# EAGLE design MSP-EXP430FR5994_EagleCAD (EAGLE 7.5.0)
DRAWN: Mike Stein; REV: 1.1

## Sheet 1 of 7
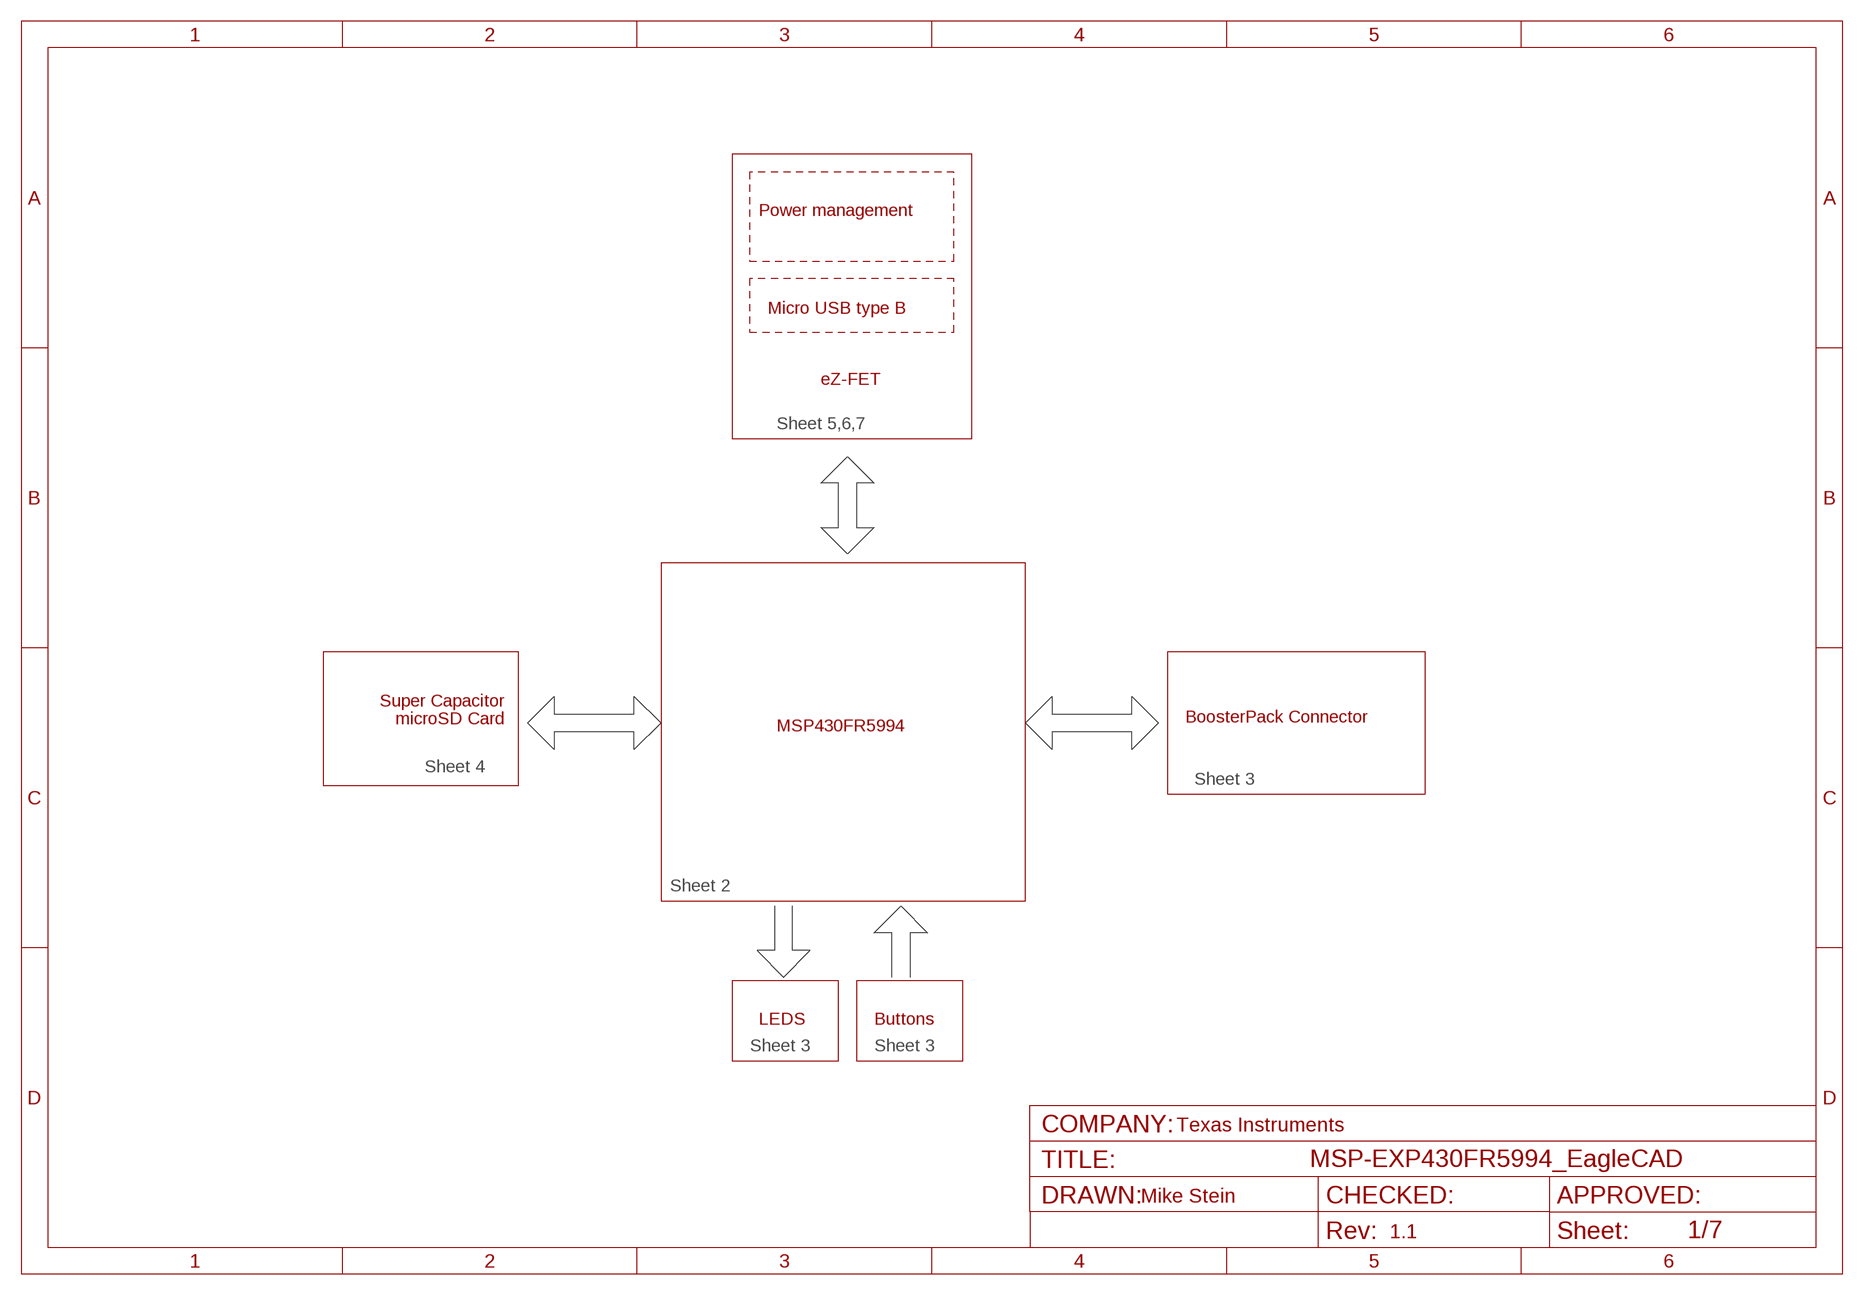
[diagram p0: schematic, sheet 1]

### Notes on the sheet
- Power management
- Micro USB type B
- eZ-FET
- Sheet 5,6,7
- Super Capacitor
- microSD Card
- BoosterPack Connector
- MSP430FR5994
- Sheet 4
- Sheet 3
- Sheet 2
- LEDS | Buttons
- Sheet 3 | Sheet 3
- Texas Instruments

## Sheet 2 of 7
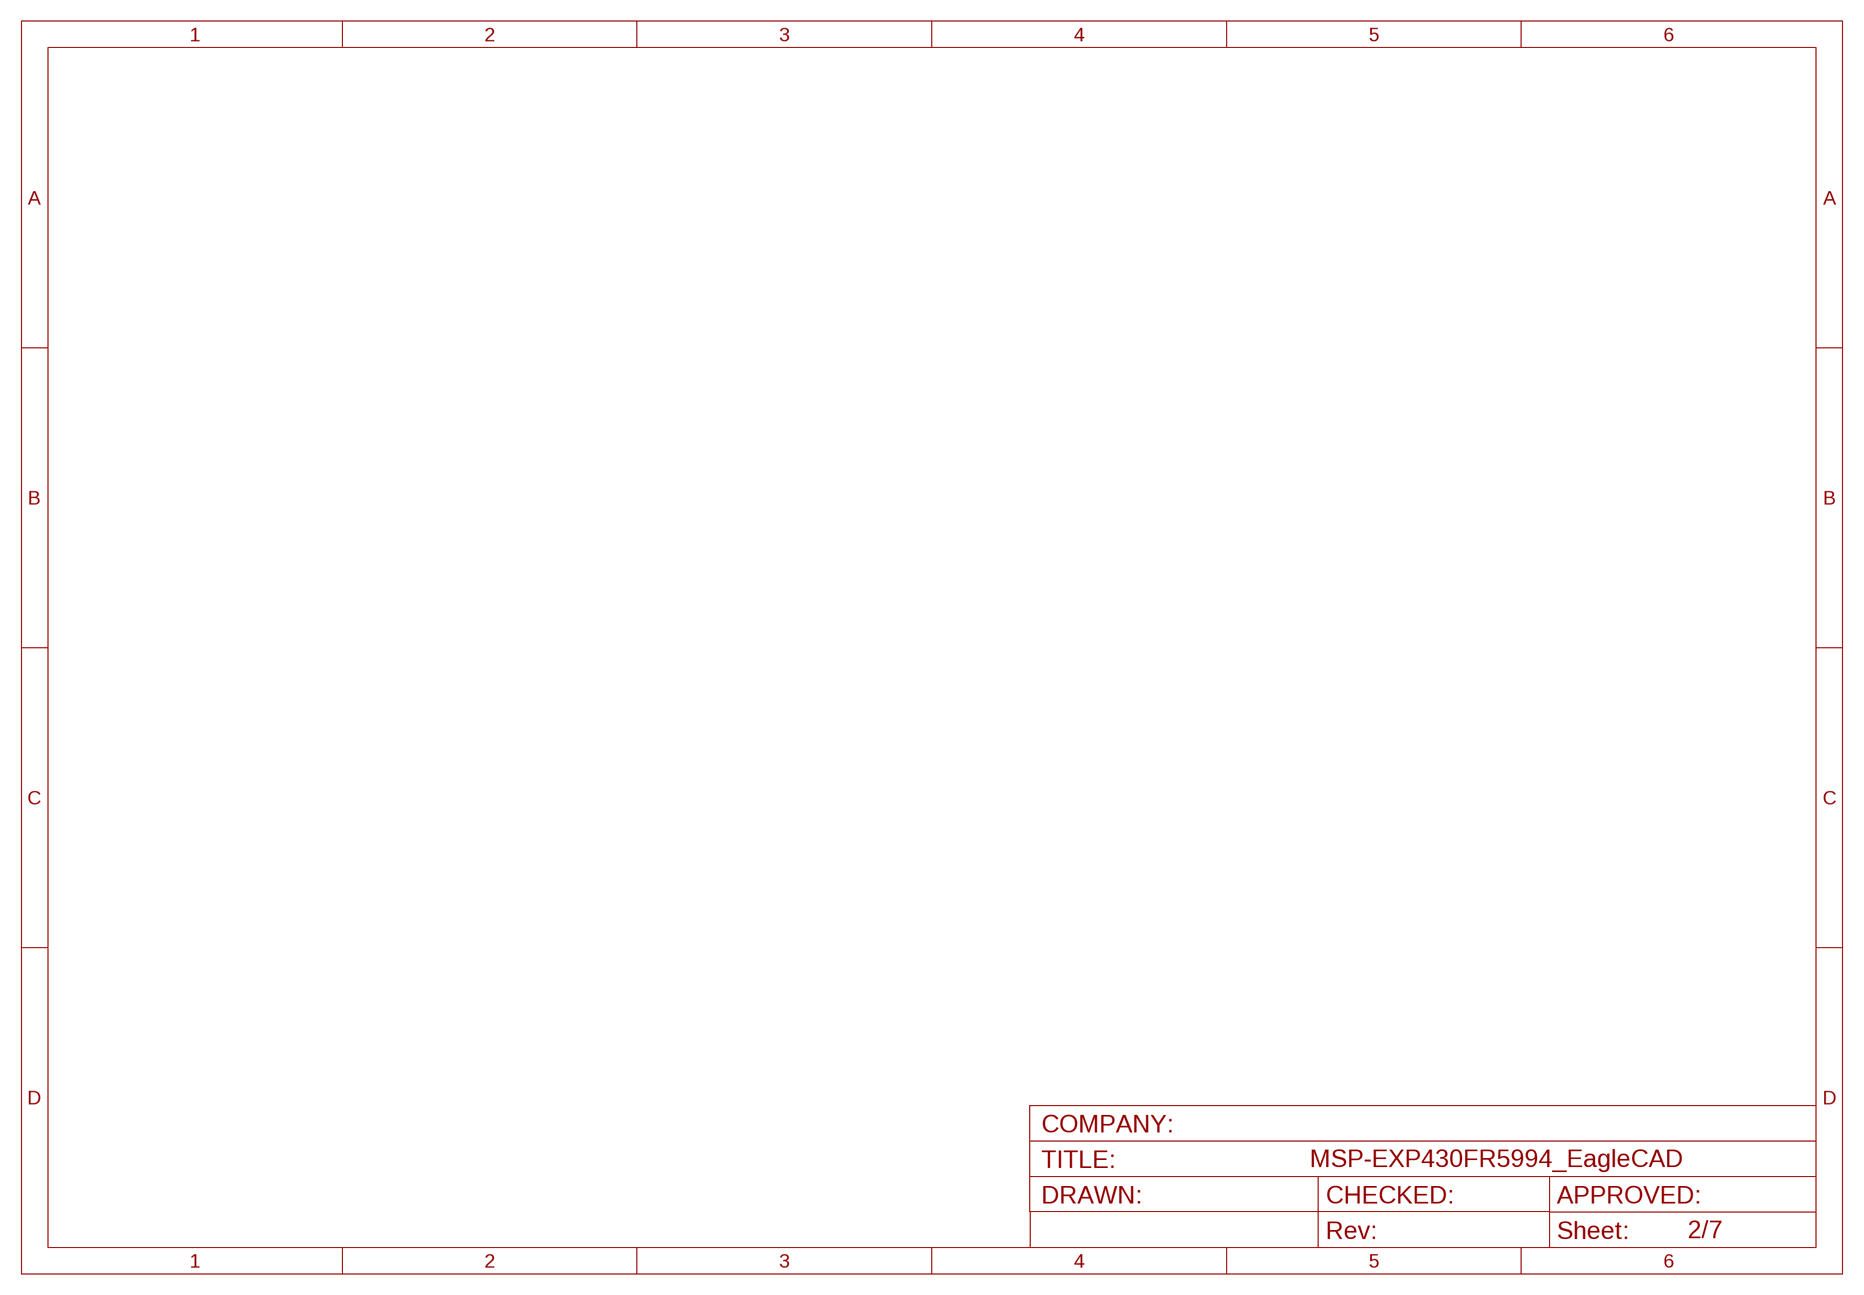
[diagram p1: schematic, sheet 2]

## Sheet 3 of 7
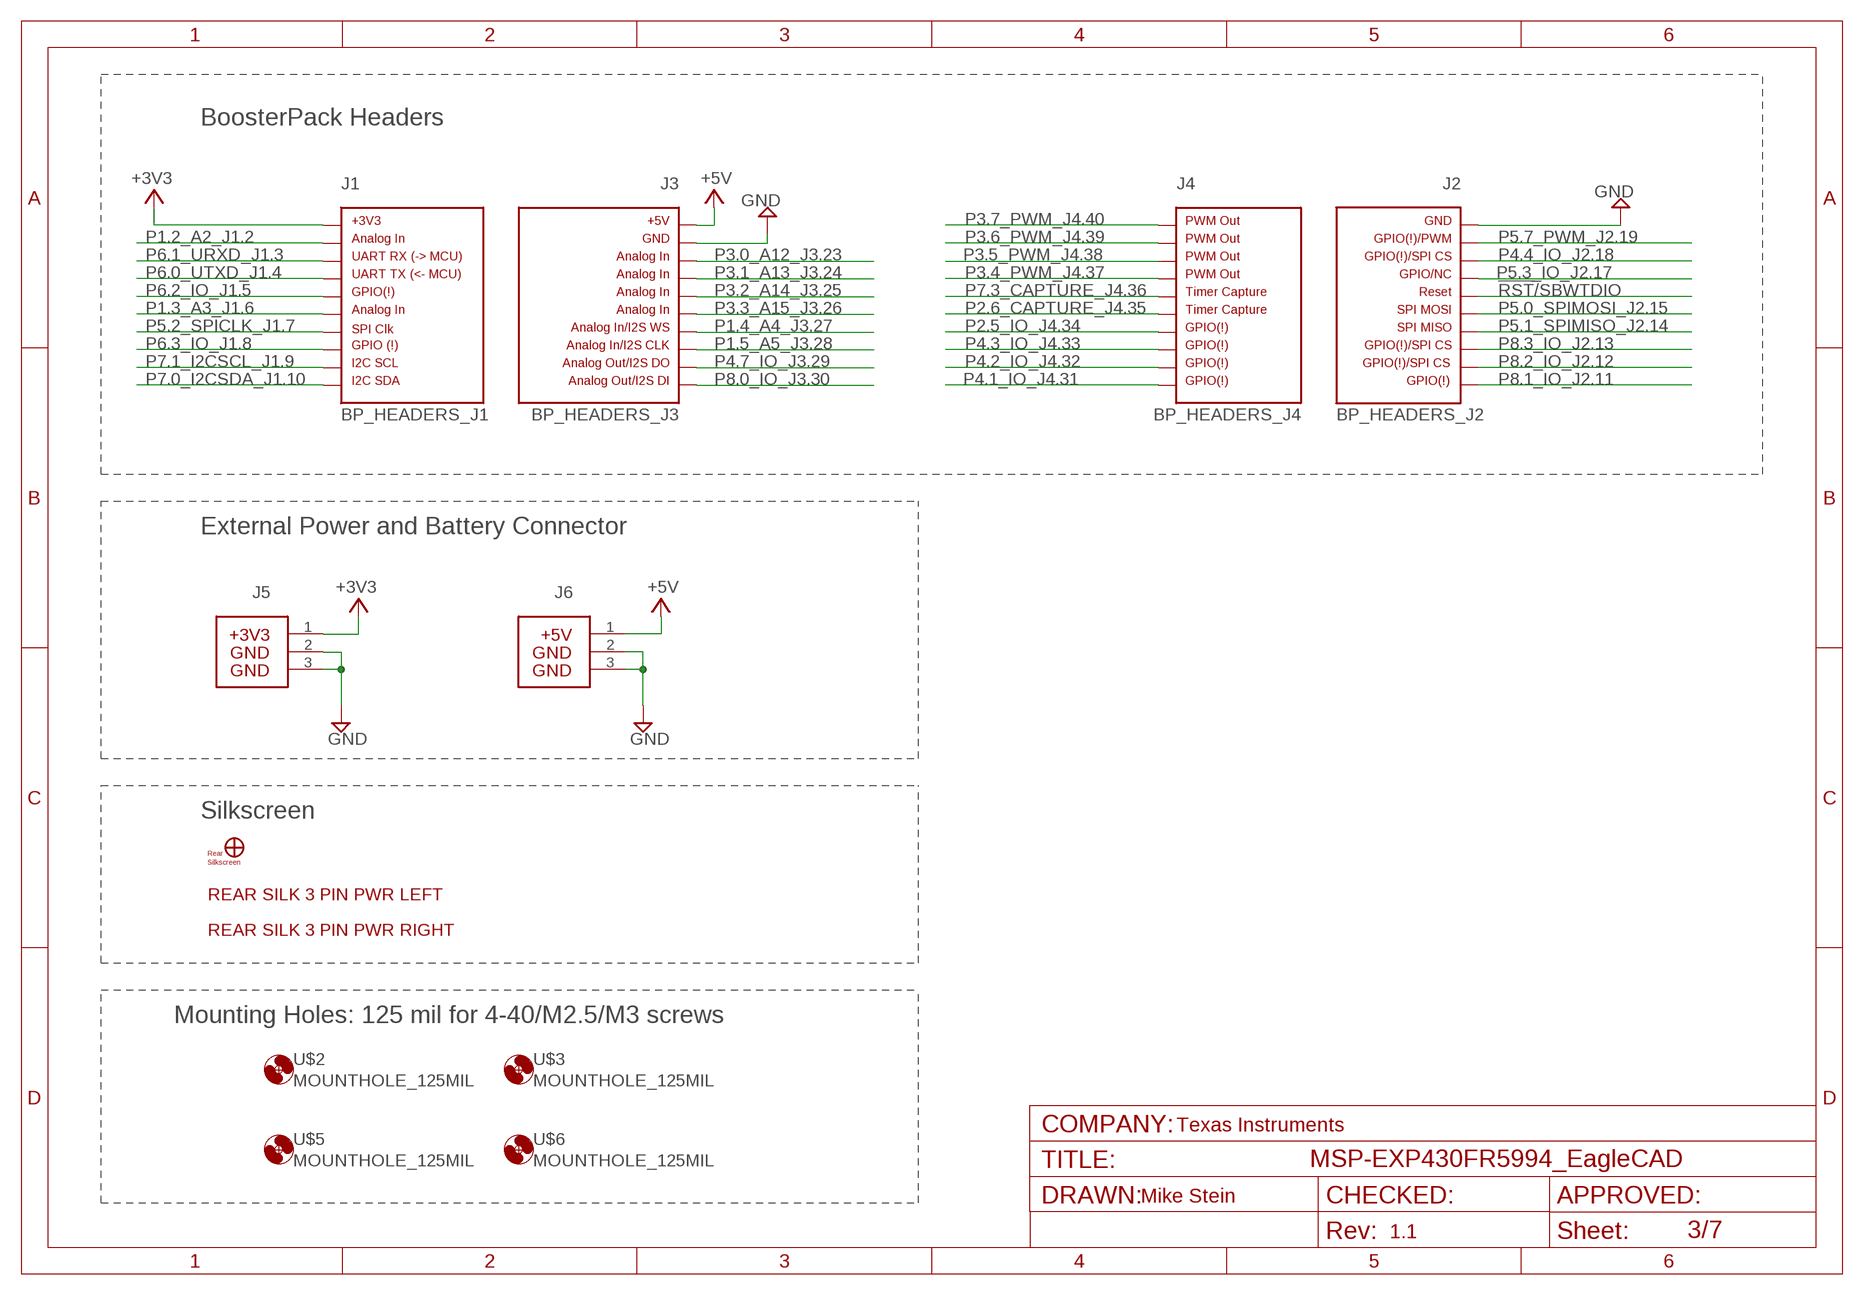
[diagram p2: schematic, sheet 3]

### Parts
J1  BP_HEADERS_J1  [J1]
J2  BP_HEADERS_J2  [J2]
J3  BP_HEADERS_J3  [J3]
J4  BP_HEADERS_J4  [J4]
J5  HEADER 1X03  BP_HEADERS_PWR_3V3100-TH  [3PIN_PWR_3V3]
J6  BP_HEADERS_PWR_5V  [3PIN_PWR_5V]
U$1  FR5994_REARSILK_REV1_0  [FR5994_REARSILK_REV1_0]
U$2  MOUNTHOLE_125MIL  [MOUNTHOLE_125MIL]
U$3  MOUNTHOLE_125MIL  [MOUNTHOLE_125MIL]
U$5  MOUNTHOLE_125MIL  [MOUNTHOLE_125MIL]
U$6  MOUNTHOLE_125MIL  [MOUNTHOLE_125MIL]
U$7  MIKE_TM  [MIKE_TM]
U$8  BP_3PIN_SILK  [3PIN_PWR_SILK]
U$10  BP_3PIN_SILK_RT  [3PIN_PWR_SILK_RT]

### Nets
!RST!/SBWTDIO: J2.16
+3V3: J1.1 J5.1
+5V: J3.21 J6.1
P1.2_A2_J1.2: J1.2
P1.3_A3_J1.6: J1.6
P1.4_A4_J3.27: J3.27
P1.5_A5_J3.28: J3.28
P2.5_IO_J4.34: J4.34
P2.6_CAPTURE_J4.35: J4.35
P3.0_A12_J3.23: J3.23
P3.1_A13_J3.24: J3.24
P3.2_A14_J3.25: J3.25
P3.3_A15_J3.26: J3.26
P3.4_PWM_J4.37: J4.37
P3.5_PWM_J4.38: J4.38
P3.6_PWM_J4.39: J4.39
P3.7_PWM_J4.40: J4.40
P4.1_IO_J4.31: J4.31
P4.2_IO_J4.32: J4.32
P4.3_IO_J4.33: J4.33
P4.4_IO_J2.18: J2.18
P4.7_IO_J3.29: J3.29
P5.0_SPIMOSI_J2.15: J2.15
P5.1_SPIMISO_J2.14: J2.14
P5.2_SPICLK_J1.7: J1.7
P5.3_IO_J2.17: J2.17
P5.7_PWM_J2.19: J2.19
P6.0_UTXD_J1.4: J1.4
P6.1_URXD_J1.3: J1.3
P6.2_IO_J1.5: J1.5
P6.3_IO_J1.8: J1.8
P7.0_I2CSDA_J1.10: J1.10
P7.1_I2CSCL_J1.9: J1.9
P7.3_CAPTURE_J4.36: J4.36
P8.0_IO_J3.30: J3.30
P8.1_IO_J2.11: J2.11
P8.2_IO_J2.12: J2.12
P8.3_IO_J2.13: J2.13
TGT_GND: J2.20 J3.22 J5.2 J5.3 J6.2 J6.3 ; supply symbol labelled GND

### Notes on the sheet
- BoosterPack Headers
- External Power and Battery Connector
- Silkscreen
- Mounting Holes: 125 mil for 4-40/M2.5/M3 screws
- Texas Instruments

## Sheet 4 of 7
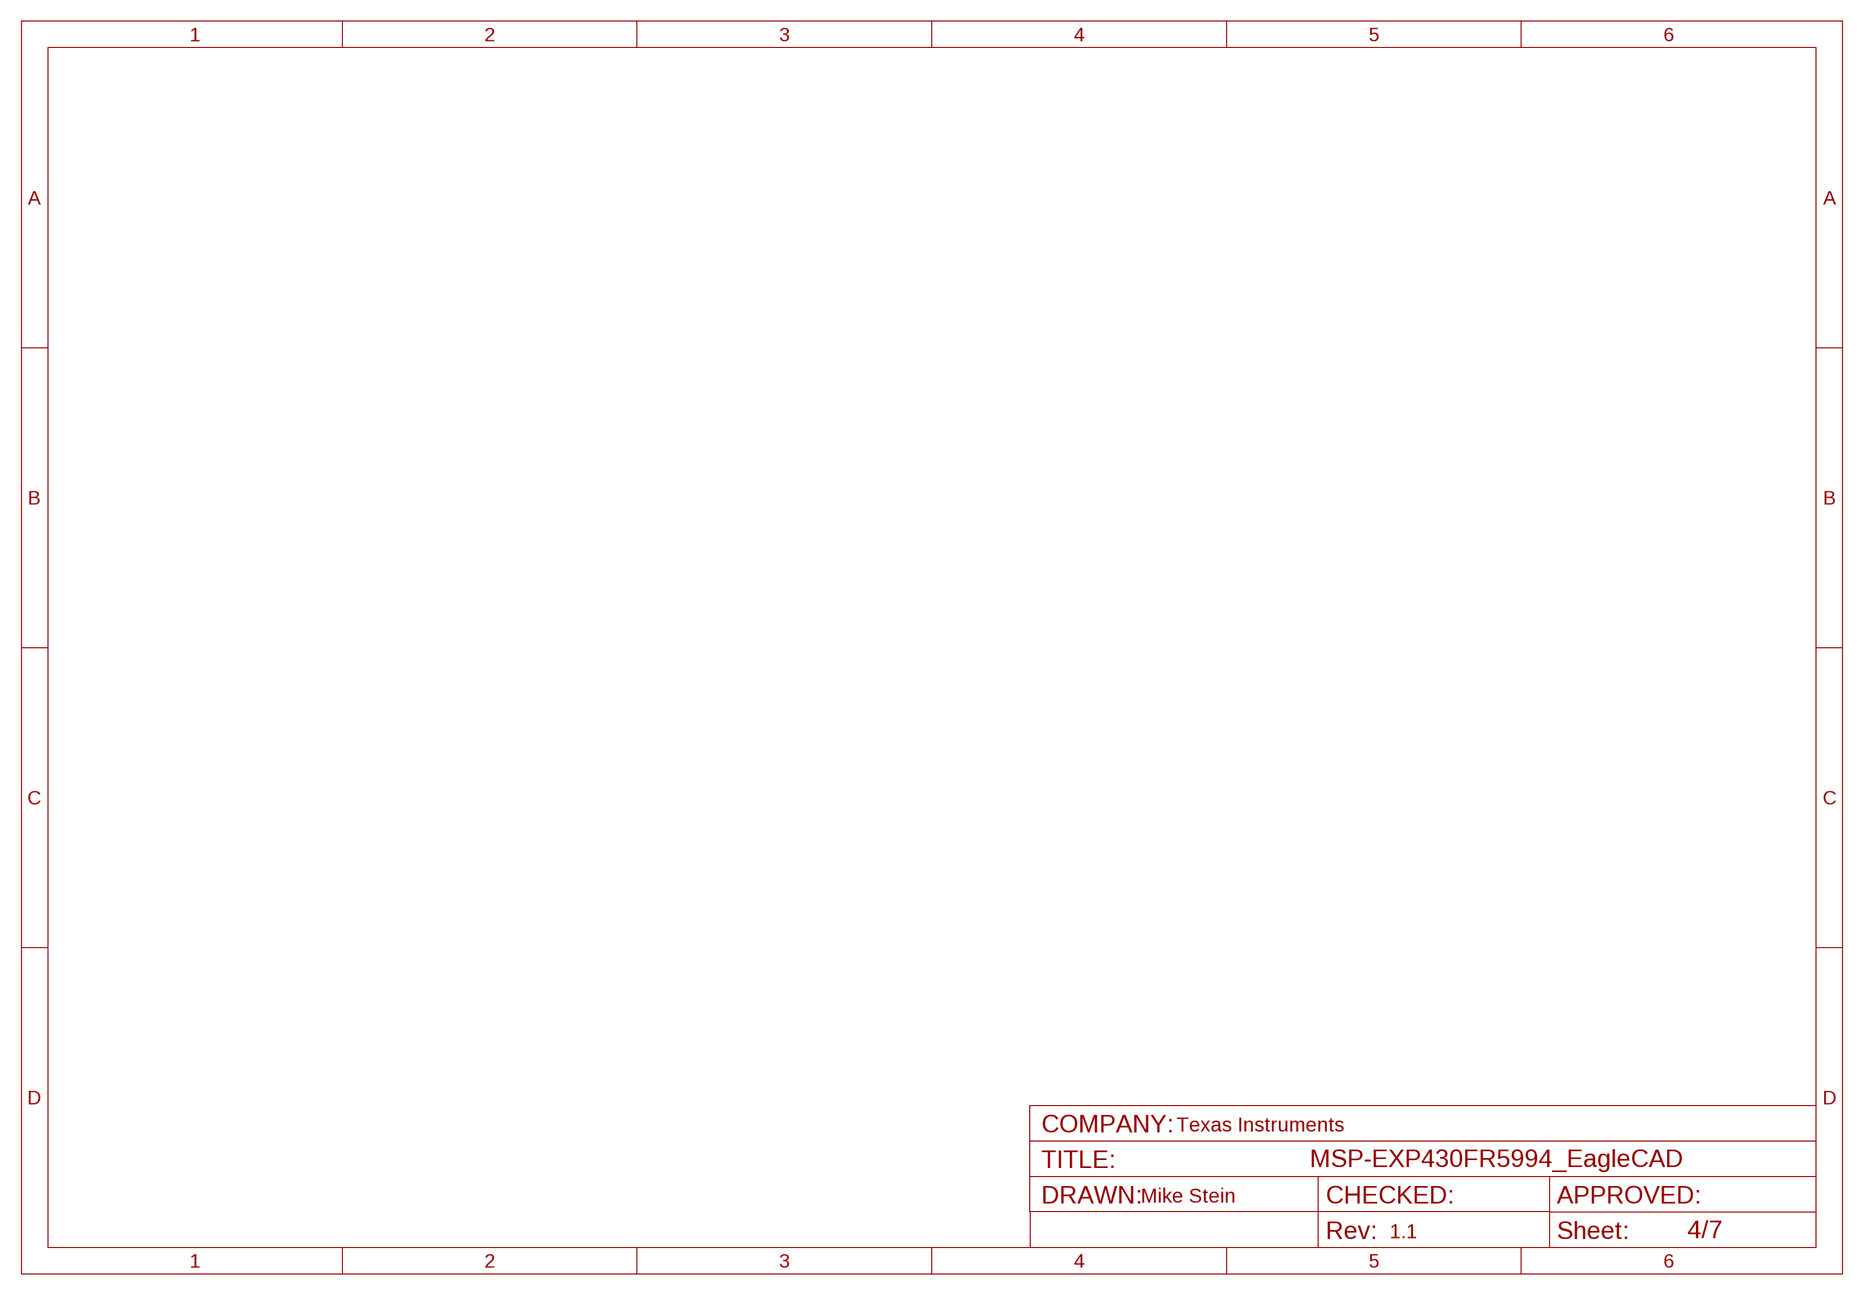
[diagram p3: schematic, sheet 4]

### Notes on the sheet
- Texas Instruments

## Sheet 5 of 7
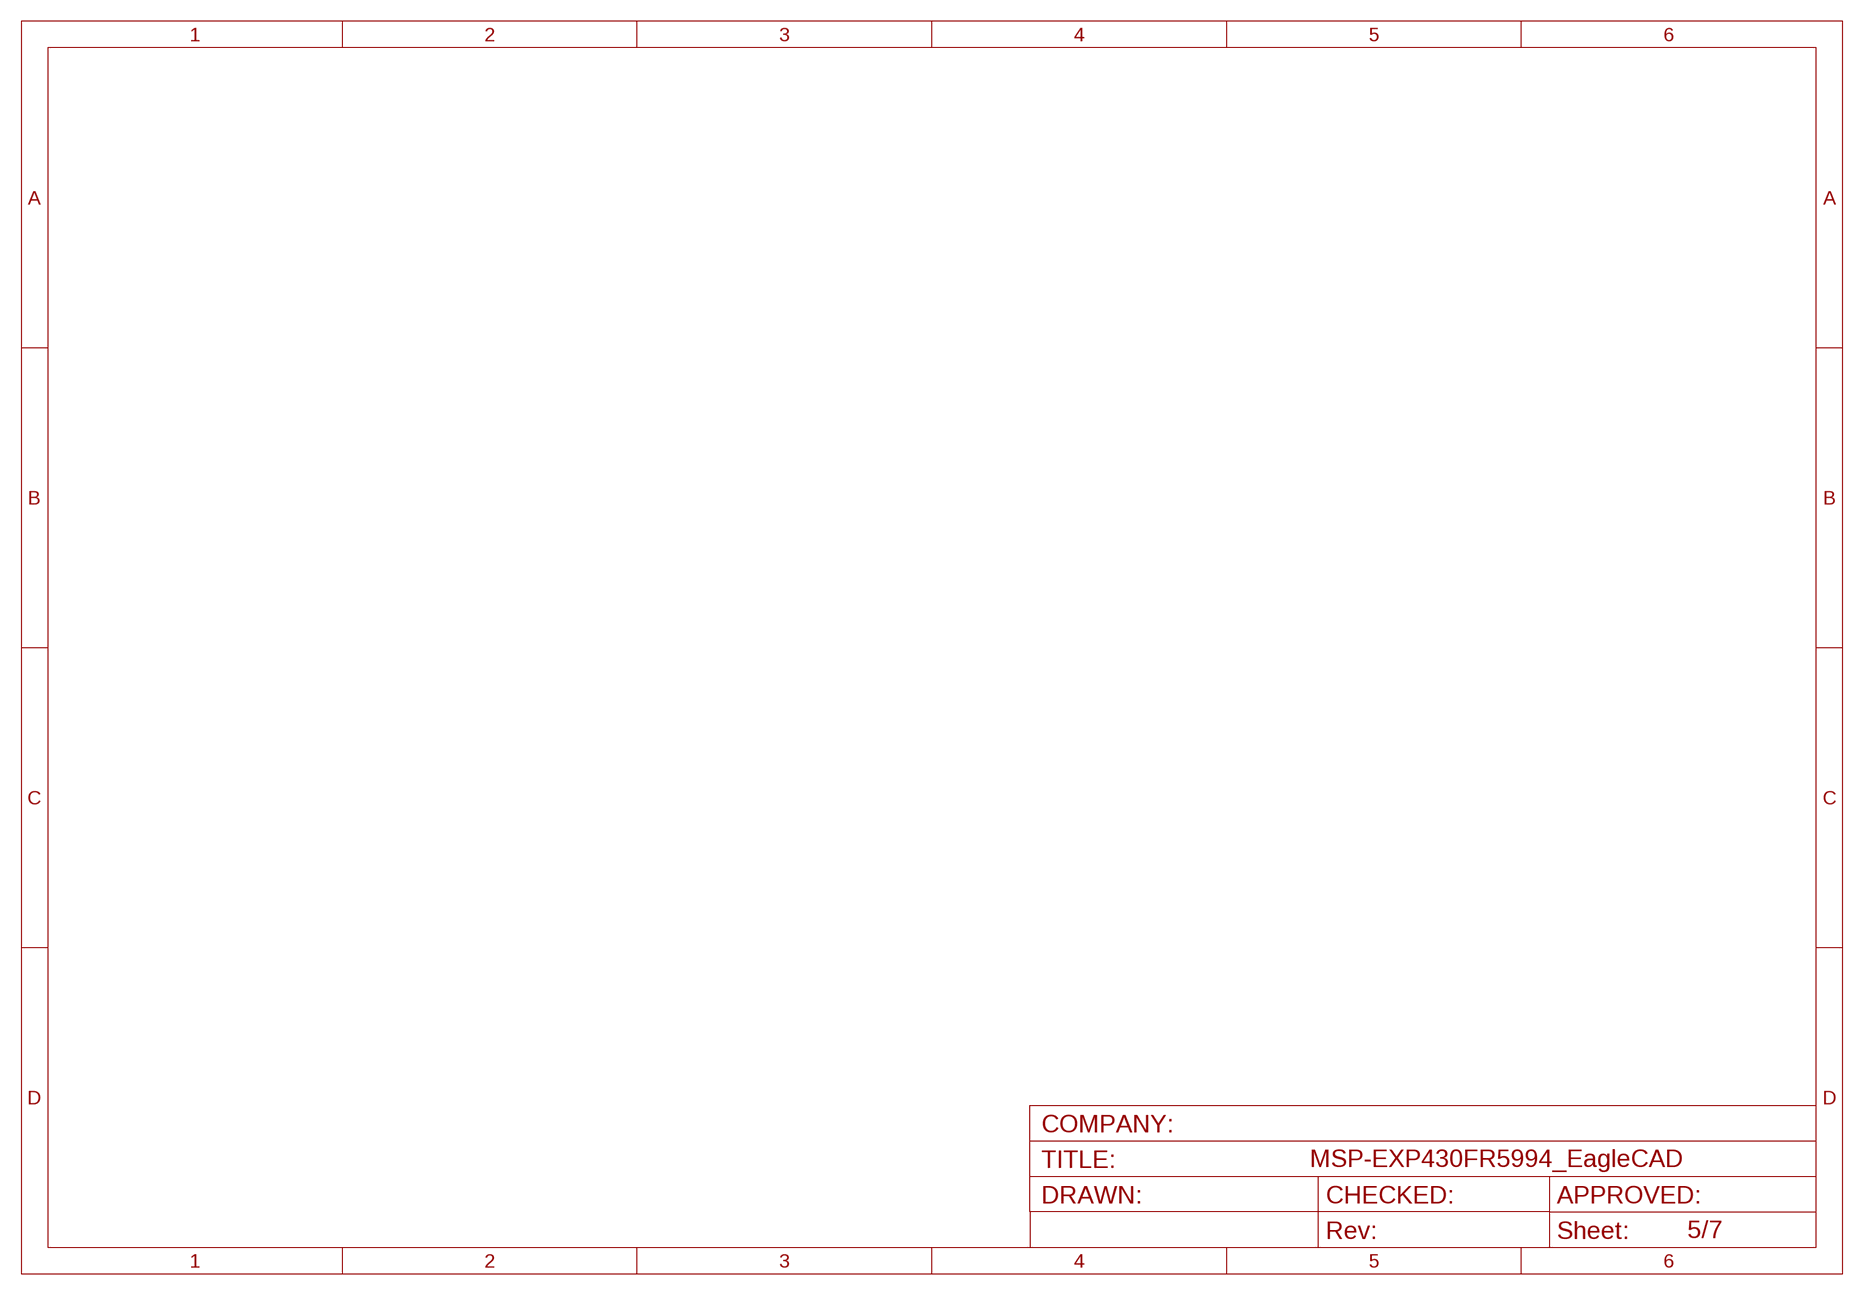
[diagram p4: schematic, sheet 5]

## Sheet 6 of 7
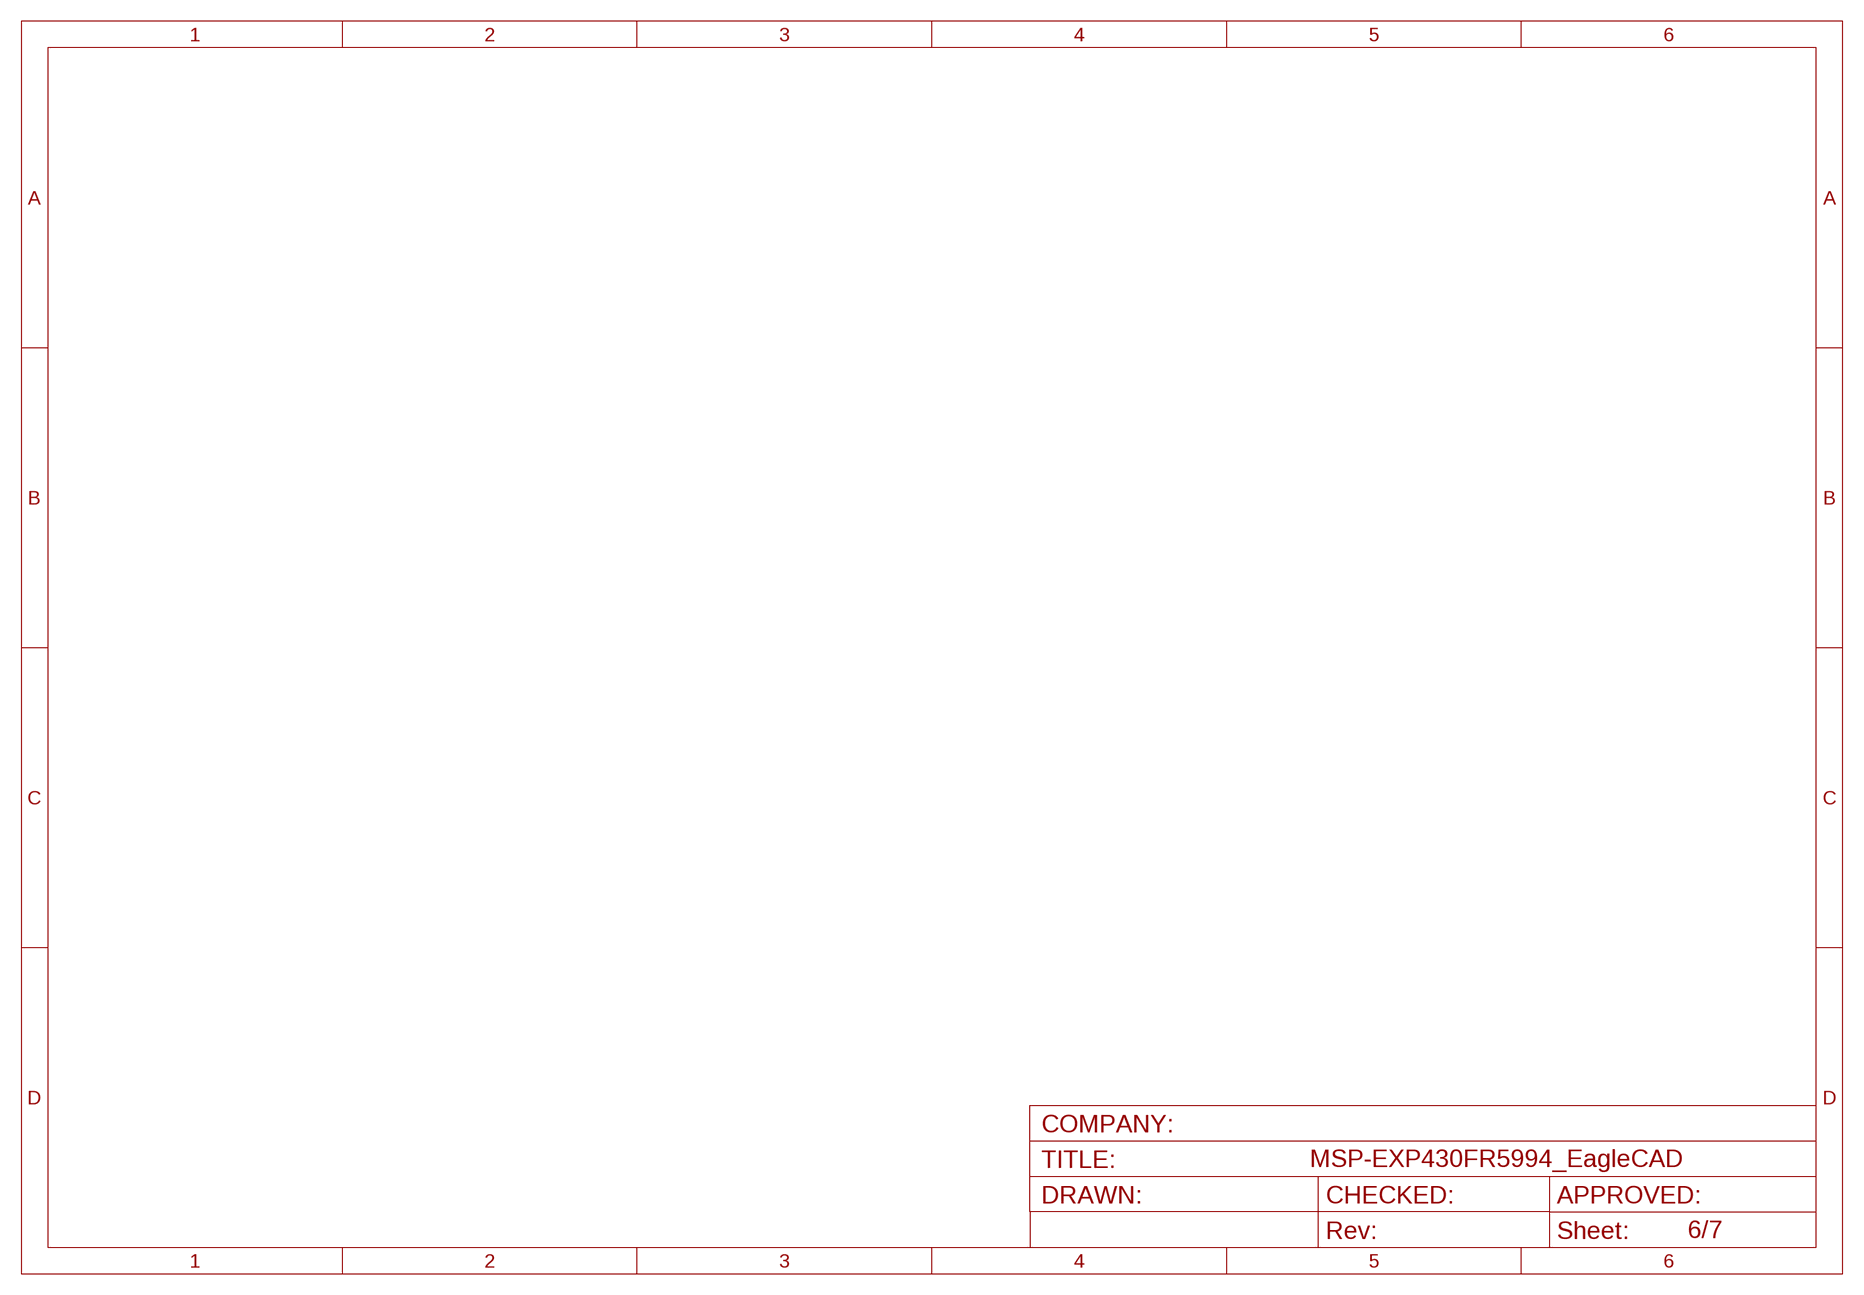
[diagram p5: schematic, sheet 6]

## Sheet 7 of 7
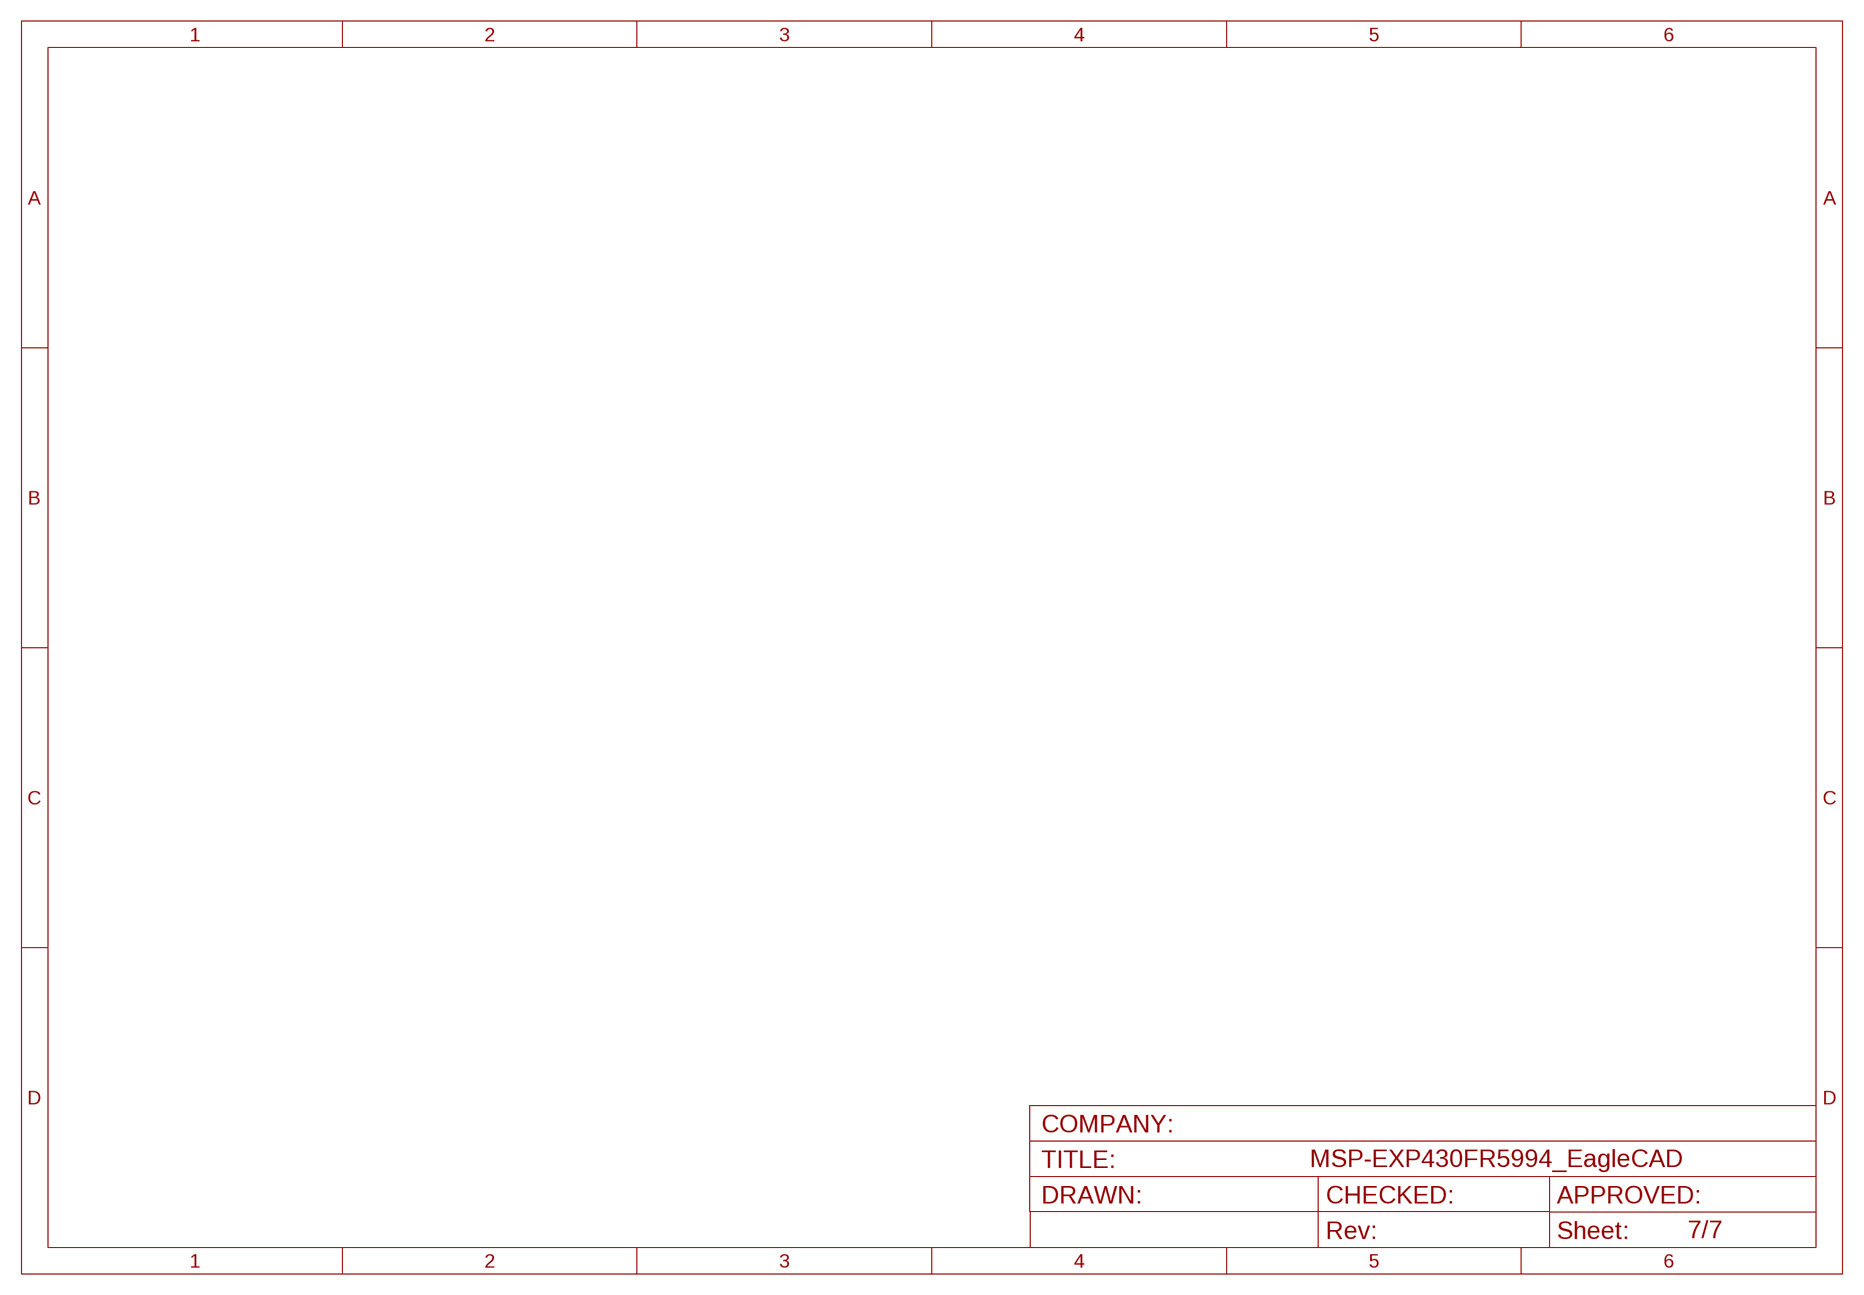
[diagram p6: schematic, sheet 7]

## Library data of the parts
J1 = LaunchPad_Template_Library:BP_HEADERS_J1
J2 = LaunchPad_Template_Library:BP_HEADERS_J2
J3 = LaunchPad_Template_Library:BP_HEADERS_J3
J4 = LaunchPad_Template_Library:BP_HEADERS_J4
J5 = LaunchPad_Template_Library:BP_HEADERS_PWR_3V3; CCO: 258-0001299; DESCRIPTION: CONN HEADER .100 SINGL STR 3POS; MAN: SULLINS
J6 = LaunchPad_Template_Library:BP_HEADERS_PWR_5V
U$1 = MSP430_Silkscreen:FR5994_REARSILK_REV1_0
U$2 U$3 U$5 U$6 = MSP-EXP432:MOUNTHOLE_125MIL
U$7 = Mike:MIKE_TM
U$8 = LaunchPad_Template_Library:BP_3PIN_SILK
U$10 = LaunchPad_Template_Library:BP_3PIN_SILK_RT

## Net classes
0 default: width 0.254 mm
1 Ground: width 0.305 mm, drill 0.305 mm, clearance 0.152 mm to class 0, clearance 0.152 mm
2 Power: width 0.406 mm, drill 0.305 mm, clearance 0.152 mm to class 0, clearance 0.152 mm to class 1, clearance 0.152 mm

## Board
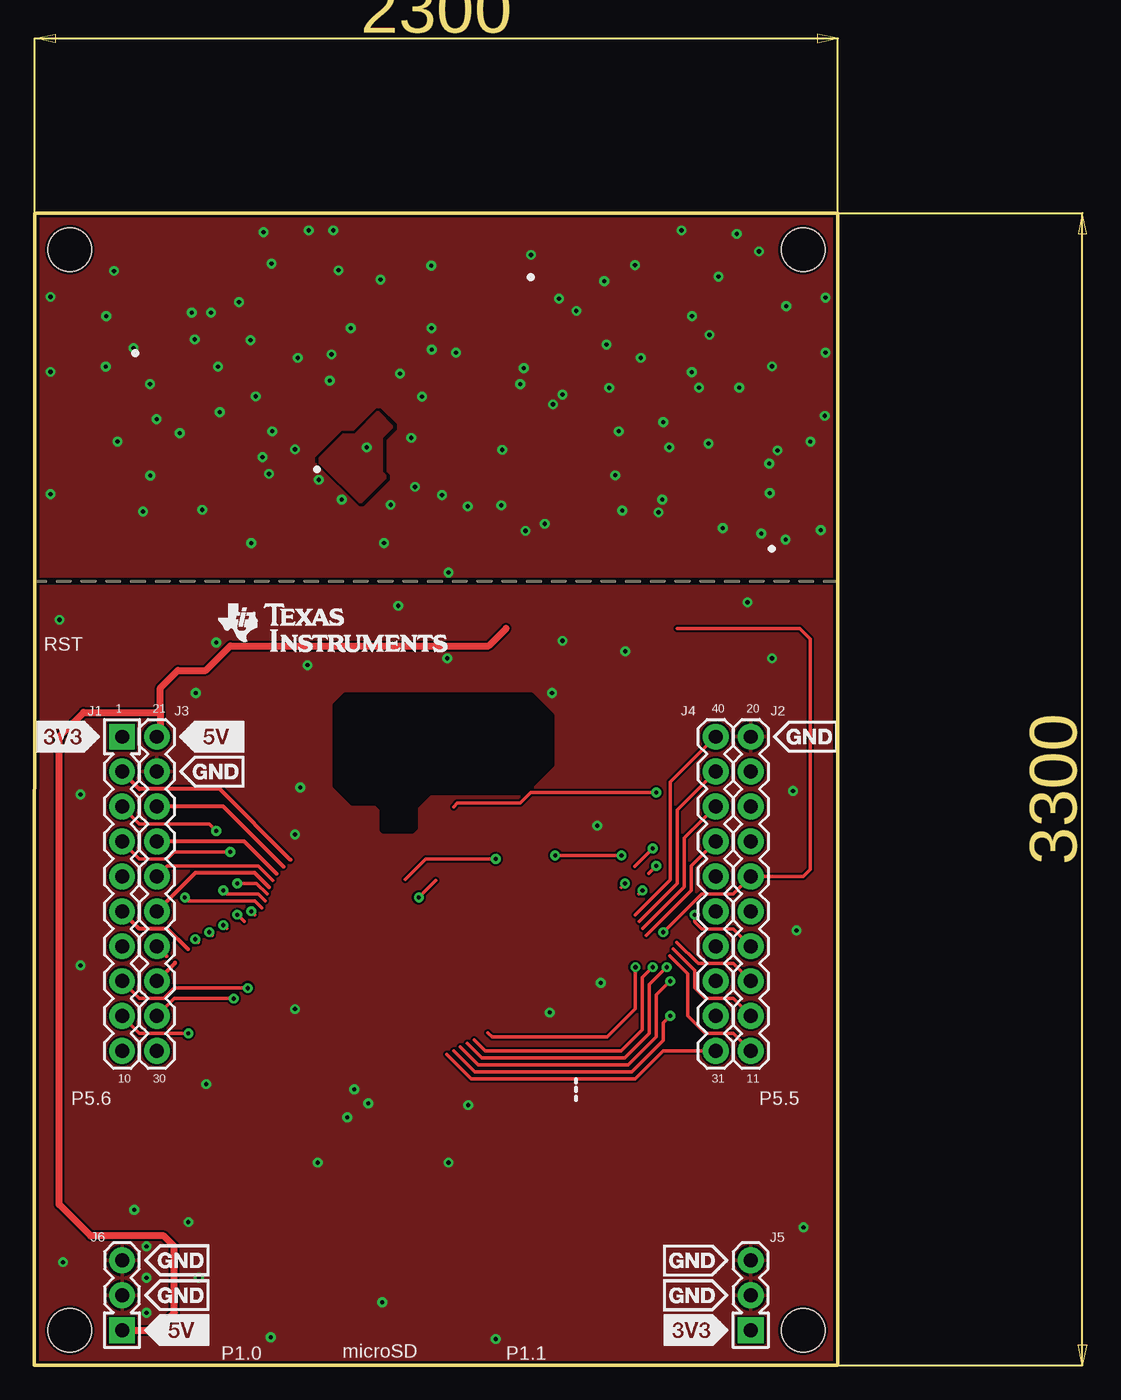
[diagram p7: board, top side]
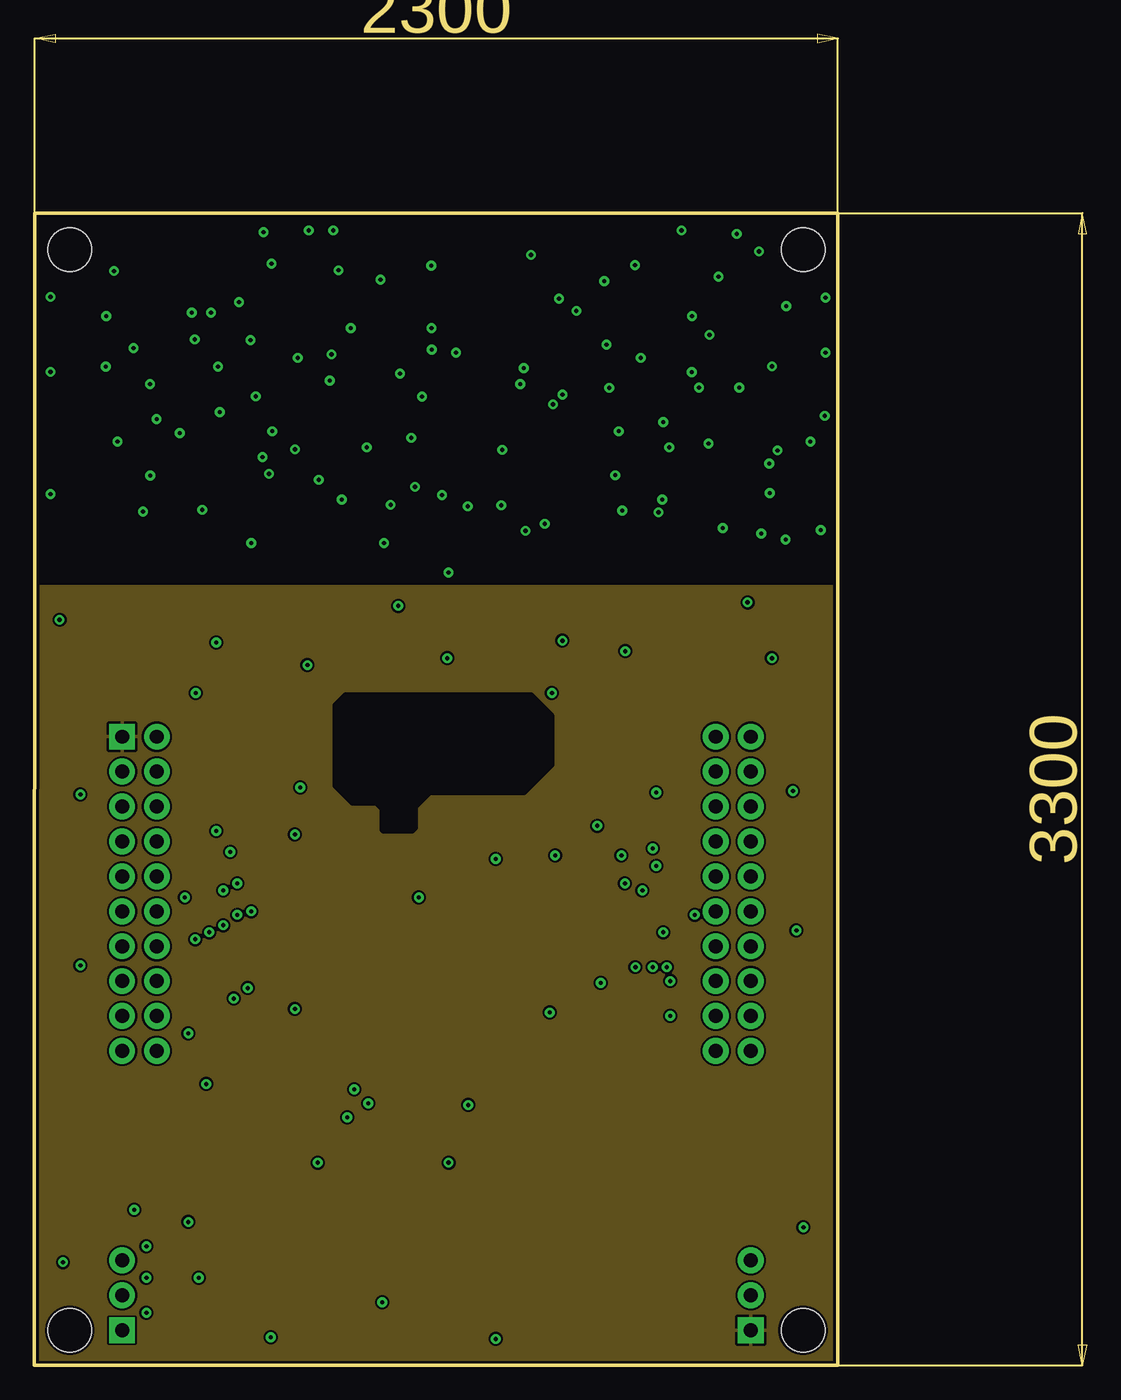
[diagram p8: board, inner layer MidTop]
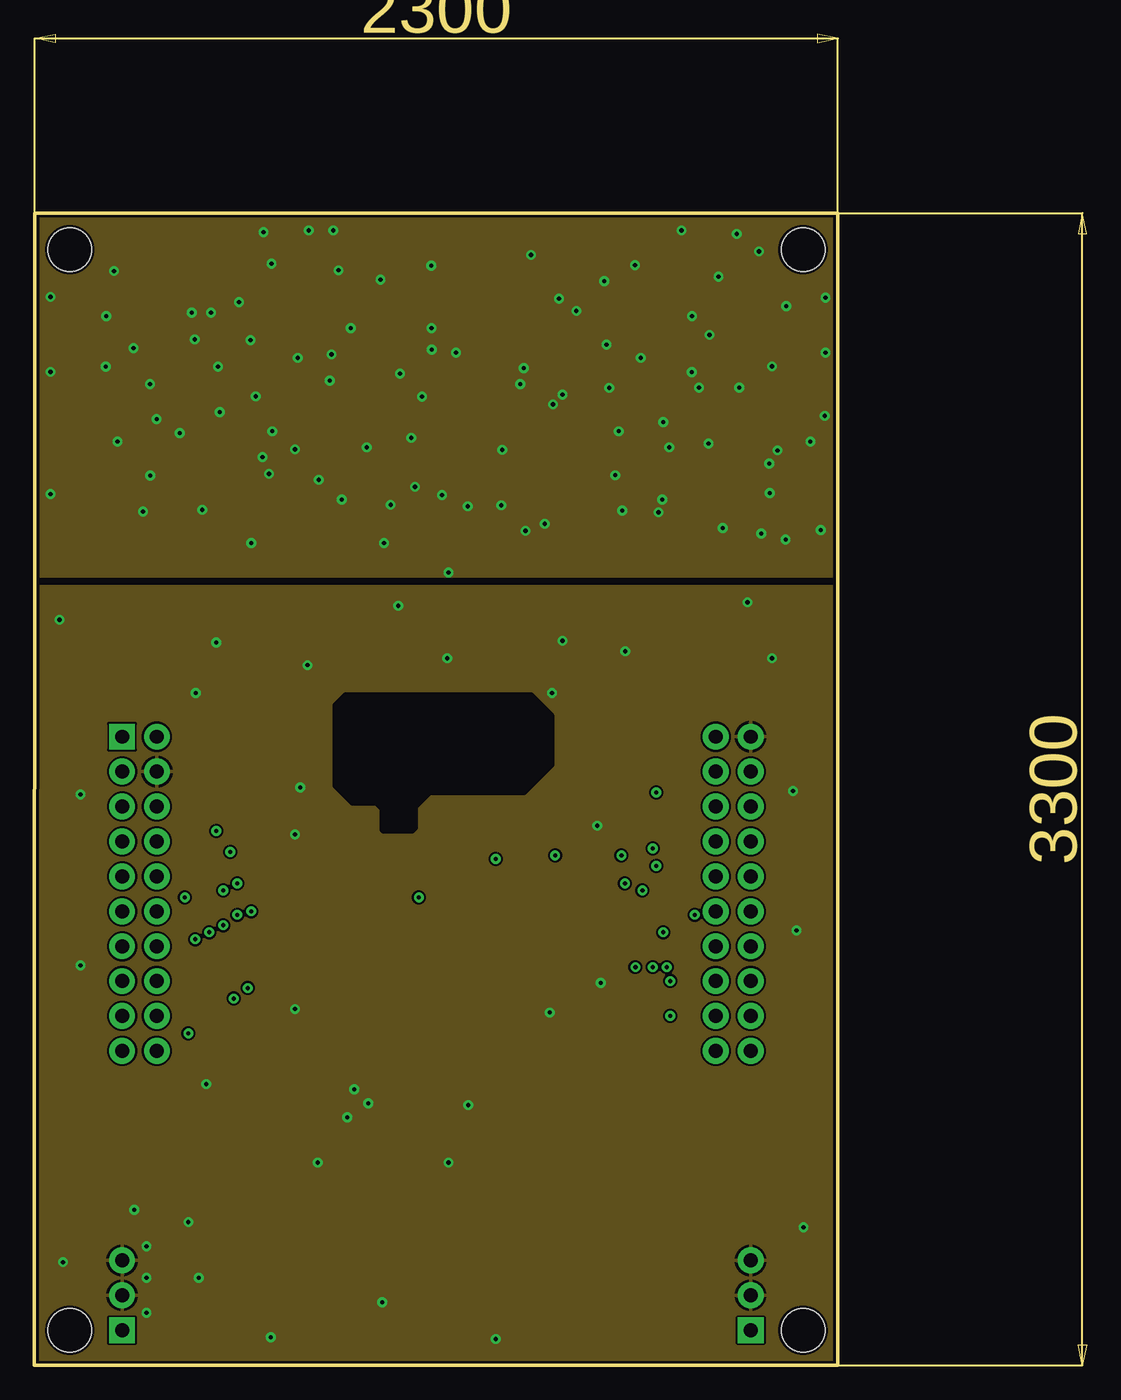
[diagram p9: board, inner layer MidBottom]
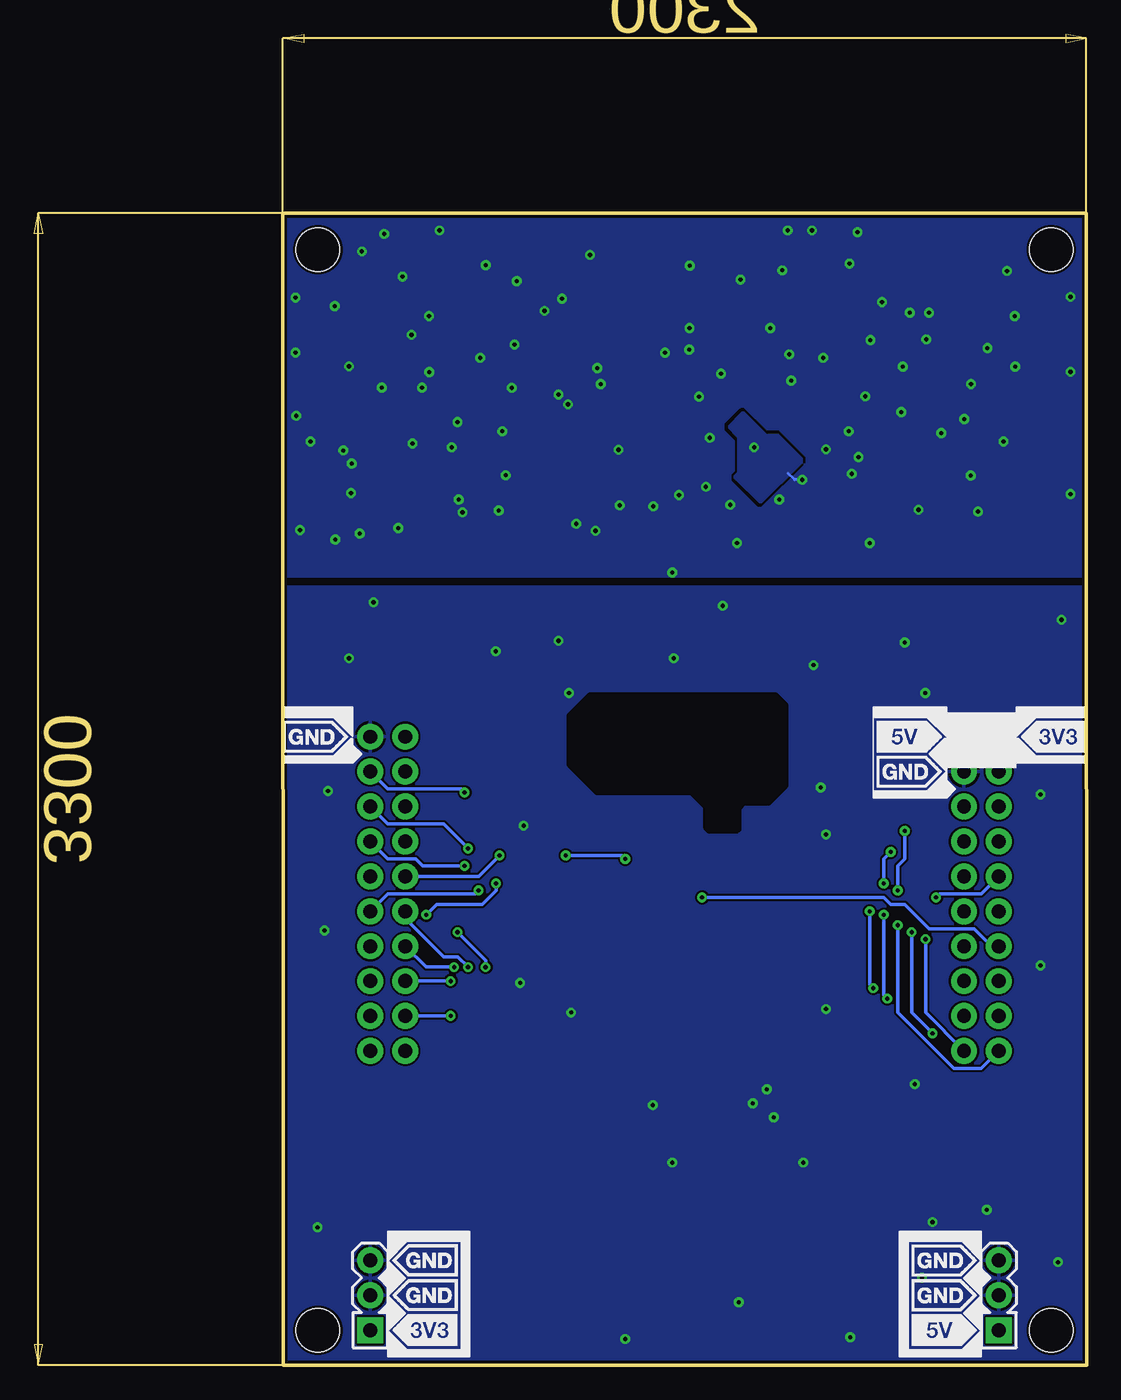
[diagram p10: board, bottom side, seen from below]

Size 58.45 x 83.82 mm. Coordinates in mm from the lower left corner, seen from the top.
Outline: 0,0 58.42,0 58.45,83.82 0.02,83.82 0,0
Copper layers (1+2*15+16): Top 0.0178mm / dielectric 12mil / MidTop 0.0356mm / dielectric 27mil / MidBottom 0.0356mm / dielectric 12mil / Bottom 0.0178mm
Design rules "MSP430 PCBExpress 4-layer-Stein": minimum track width 6mil, minimum drill 12mil, track to track 6mil, track to pad 6mil, pad to pad 6mil, via to via 8mil, smd to smd 6mil, copper to edge 8mil, drill to drill 8mil, minimum pad ring 10mil, minimum via ring 8mil, stop-mask expansion 8mil, vias tented up to drill 15mil, thermal gap 8mil
tRestrict: area 20.5,62.5 to 26.3,69.6
bRestrict: area 20.5,62.5 to 26.3,69.6

### Footprints (pad centres in the part's own frame; a part is rotated, then mirrored left to right if it is on the bottom)
J1 = drill 1.016 pad 1.88 square: 1 0,22.86 | drill 1.016 pad 1.88: 2 0,20.32; 3 0,17.78; 4 0,15.24; 5 0,12.7; 6 0,10.16; 7 0,7.62; 8 0,5.08; 9 0,2.54; 10 0,0
J2 = drill 1.016 pad 1.88: 11 0,0; 12 0,2.54; 13 0,5.08; 14 0,7.62; 15 0,10.16; 16 0,12.7; 17 0,15.24; 18 0,17.78; 19 0,20.32; 20 0,22.86
J3 = drill 1.016 pad 1.88: 21 0,22.86; 22 0,20.32; 23 0,17.78; 24 0,15.24; 25 0,12.7; 26 0,10.16; 27 0,7.62; 28 0,5.08; 29 0,2.54; 30 0,0
J4 = drill 1.016 pad 1.88: 31 0,0; 32 0,2.54; 33 0,5.08; 34 0,7.62; 35 0,10.16; 36 0,12.7; 37 0,15.24; 38 0,17.78; 39 0,20.32; 40 0,22.86
3PIN_PWR_3V3 = drill 1.016 pad 1.88 square: 1 0,0 | drill 1.016 pad 1.88: 2 0,2.54; 3 0,5.08
3PIN_PWR_5V = drill 1.016 pad 1.88 square: 1 0,0 | drill 1.016 pad 1.88: 2 0,2.54; 3 0,5.08
MOUNTHOLE_125MIL = hole 3.175: 0,0

### Placement (x,y rotation side)
DRAW1  [LOGO-ROCKET-10X7MM-BRD]  2.84,63.13 56 top
DRAW3  [LOGO-ROCKET-10X7MM-BRD]  10.52,15.59 7 top
J1  6.38,22.86 0 top
J2  52.1,22.86 0 top
J3  8.91,22.86 0 top
J4  49.55,22.86 0 top
J5  52.1,2.54 0 bottom
J6  6.38,2.54 0 bottom
U$1  0.02,0 0 top
U$2  2.56,2.54 0 top
U$3  2.56,81.15 0 top
U$4  [LOGO16_TPLACE]  13.28,51.73 0 top
U$5  55.91,2.54 0 top
U$6  55.91,81.15 0 top
U$7  25.17,8.13 0 top
U$8  7.65,0.61 0 top
U$10  50.83,0.61 0 top

### Tracks (layer width: path | path; a pad name or v marks a point on that pad's centre or on a via)
!RST!/SBWTDIO  (via drill 0.3)
  Top 0.254: 46.76,53.59 55.65,53.59 56.41,52.83 56.41,36.07 55.91,35.56 J2.16 50.83,34.29 48.54,34.29 v45.75,31.5 | 32.98,24.19 33.3,23.88 41.68,23.88 43.71,25.91 v43.71,28.96
  Bottom 0.254: v43.71,28.96 43.71,29.46 v45.75,31.5
+3V3
  Top 0.406: J1.1 6.38,45.64
  pour MidTop: 0.02,56.64 0.02,0 58.45,0 58.45,56.64
+5V
  Top 0.508: 34.32,53.59 33.05,52.32 14.25,52.32 12.47,50.55 10.44,50.55 9.17,49.28 9.17,47.5 | J6.1 8.91,2.54 10.18,3.81 10.18,8.64 9.42,9.4 4.09,9.4 1.8,11.68 1.8,45.72 3.58,47.5 9.17,47.5 | 9.17,47.5 9.17,45.97 J3.21
GND  (via drill 0.3)
  Bottom 0.203: v20.68,64.41 21.23,64.41 21.72,64.9
  other vias: 10.57,67.82 8.89,68.83 51.08,82.3 41.45,78.87 24.18,66.78 35.33,71.37 19.96,82.55 23.01,75.44 53.49,63.45 43.69,80.04 46.18,66.78 45.75,68.61 47.83,76.33 44.09,73.28 52.7,81.03 17.25,80.14 47.07,82.55 35.59,72.54 48.34,71.12 49.1,74.96 8.43,64.72 16.59,66.07 25.17,78.97 28.85,79.98 17.07,64.85 22.35,62.97 18.95,66.62 27.41,67.46 30.66,73.66 12.22,62.23 22.12,79.65 5.18,72.64 5.23,76.33 16.66,82.42 5.79,79.6 15.72,74.57 13.49,69.34 11.66,74.63 14.88,77.34 16.1,70.48 8.41,71.37 11.45,76.58 27.69,63.91 47.8,72.24 38.4,70.61 41.6,74.24 42.49,67.94 49.76,79.2 21.61,73.53 41.81,71.09 7.9,62.1 1.17,63.37 1.17,72.26 1.17,77.72 21.74,82.55 57.2,60.76 57.48,69.06 57.53,73.66 57.53,77.67 54.69,77.04 56.44,67.18 54.64,60.07 25.43,59.82 30.12,57.66 15.77,59.82 25.91,62.59 6.04,67.18 19.15,73.28 17.3,67.94 26.59,72.14 28.19,70.46 38.15,77.6 39.42,76.71 21.49,71.63 7.21,73.99 12.85,76.58 13.36,72.64 28.9,73.89 53.64,72.67 37.72,69.9 34.04,66.6 52.86,60.5 49.02,67.06 54.05,66.55 50.06,60.91 53.44,65.58 45.67,62.97 51.26,71.12 28.88,75.44 36.12,80.77 42.24,64.74 37.11,61.21 45.39,62.05 42.75,62.18 29.64,63.3 33.96,62.56 31.52,62.48 35.71,60.71
  pour Top: 0.02,57.4 58.45,57.4 58.45,83.82 0.02,83.82
  pour Bottom: 0.02,57.4 58.45,57.4 58.45,83.82 0.02,83.82
  pour MidBottom: 0.02,83.82 58.45,83.82 58.45,57.4 0.02,57.4
N$5
  cutout MidBottom: 25.3,38.99 25.3,40.51 24.92,40.89 23.14,40.89 21.87,42.16 21.87,48.01 22.63,48.77 36.09,48.77 37.62,47.24 37.62,43.69 35.59,41.66 28.73,41.66 27.71,40.64 27.71,39.12 27.46,38.86 25.43,38.86
  cutout Top: 25.3,38.99 25.3,40.51 24.92,40.89 23.14,40.89 21.87,42.16 21.87,48.01 22.63,48.77 36.09,48.77 37.62,47.24 37.62,43.69 35.59,41.66 28.73,41.66 27.71,40.64 27.71,39.12 27.46,38.86 25.43,38.86
  cutout MidTop: 25.3,38.99 25.3,40.51 24.92,40.89 23.14,40.89 21.87,42.16 21.87,48.01 22.63,48.77 36.09,48.77 37.62,47.24 37.62,43.69 35.59,41.66 28.73,41.66 27.71,40.64 27.71,39.12 27.46,38.86 25.43,38.86
  cutout Bottom: 25.3,38.99 25.3,40.51 24.92,40.89 23.14,40.89 21.87,42.16 21.87,48.01 22.63,48.77 36.09,48.77 37.62,47.24 37.62,43.69 35.59,41.66 28.73,41.66 27.71,40.64 27.71,39.12 27.46,38.86 25.43,38.86
P1.2_A2_J1.2
  Top 0.305: 18.63,36.77 13.49,41.91 7.65,41.91 J1.2
P1.3_A3_J1.6
  Top 0.305: 11.16,30.27 9.68,31.75 7.65,31.75 J1.6
P1.4_A4_J3.27
  Top 0.305: 9.62,29.77 J3.27
P1.5_A5_J3.28
  Top 0.305: 10.25,29.27 J3.28
P2.5_IO_J4.34  (via drill 0.3)
  Top 0.254: 31.48,23.4 32.54,22.35 42.95,22.35 44.73,24.13 44.73,27.69 v46,28.96
  Bottom 0.254: v46,28.96 48.03,28.96 J4.34
P2.6_CAPTURE_J4.35  (via drill 0.3)
  Top 0.254: 31.98,23.67 32.79,22.86 42.7,22.86 44.22,24.38 44.22,28.19 v44.98,28.96
  Bottom 0.254: v44.98,28.96 45.75,29.72 46.76,29.72 49.55,32.51 J4.35
P3.0_A12_J3.23
  Top 0.305: 18.11,36.27 13.74,40.64 J3.23
P3.1_A13_J3.24
  Top 0.305: 17.59,35.77 15.27,38.1 J3.24
P3.2_A14_J3.25
  Top 0.254: 17.33,35.27 16.28,36.32 9.68,36.32 J3.25
P3.3_A15_J3.26
  Top 0.305: 17.07,34.77 16.03,35.81 11.71,35.81 J3.26
P3.4_PWM_J4.37
  Top 0.254: 44.5,31.27 47.78,34.54 47.78,36.32 J4.37
P3.5_PWM_J4.38
  Top 0.254: 44.24,31.77 47.27,34.8 47.27,38.35 J4.38
P3.6_PWM_J4.39
  Top 0.254: 43.98,32.27 46.76,35.05 46.76,40.39 J4.39
P3.7_PWM_J4.40
  Top 0.254: 43.72,32.77 46.25,35.31 46.25,42.42 J4.40
P4.1_IO_J4.31
  Top 0.254: 29.98,22.62 31.78,20.83 43.71,20.83 45.75,22.86 J4.31
P4.2_IO_J4.32  (via drill 0.3)
  Top 0.254: 30.48,22.88 32.03,21.34 43.46,21.34 45.75,23.62 45.75,24.89 v46.25,25.4
  Bottom 0.254: v46.25,25.4 J4.32
P4.3_IO_J4.33  (via drill 0.3)
  Top 0.254: 46,27.94 v46.25,27.94 45.24,26.92 45.24,23.88 43.21,21.84 32.28,21.84 30.98,23.14
  Bottom 0.254: v46.25,27.94 J4.33
P4.4_IO_J2.18  (via drill 0.3)
  Top 0.254: 43.66,36.27 v44.98,37.59
  Bottom 0.254: v44.98,37.59 46.76,39.37 50.83,39.37 J2.18
P4.7_IO_J3.29  (via drill 0.3)
  Top 0.254: 15.25,32.27 v14.76,32.77 | v14.5,26.67 10.18,26.67 J3.29
  Bottom 0.254: v14.76,32.77 14.76,26.92 v14.5,26.67
P5.0_SPIMOSI_J2.15  (via drill 0.3)
  Top 0.254: 43.95,34.27 v44.22,34.54
  Bottom 0.254: v44.22,34.54 44.48,34.29 50.83,34.29 J2.15
P5.1_SPIMISO_J2.14  (via drill 0.3)
  Top 0.254: 42.67,34.77 v42.95,35.05 | v48.03,32.77 48.03,32.26 48.54,31.75 50.83,31.75 J2.14
  Bottom 0.254: v42.95,35.05 42.95,34.54 43.97,33.53 47.27,33.53 v48.03,32.77
P5.2_SPICLK_J1.7  (via drill 0.3)
  Top 0.254: v27.96,34.04 29.2,35.27
  Bottom 0.254: J1.7 6.88,30.48 8.15,31.75 11.45,31.75 13.23,33.53 14.25,33.53 14.76,34.04 v27.96,34.04
P5.3_IO_J2.17  (via drill 0.3)
  Top 0.254: 44.69,35.77 v45.24,36.32
  Bottom 0.254: v45.24,36.32 48.29,36.32 48.79,36.83 50.83,36.83 J2.17
P5.7_PWM_J2.19  (via drill 0.3)
  Top 0.254: 30.48,40.62 30.76,40.89 35.33,40.89 36.09,41.66 v45.24,41.66
  Bottom 0.254: v45.24,41.66 45.49,41.91 50.83,41.91 J2.19
P6.0_UTXD_J1.4  (via drill 0.3)
  Top 0.254: J1.4 7.65,36.83 9.68,36.83 10.18,37.34 v14.25,37.34 | 16.94,34.27 16.15,35.05 v14.76,35.05
  Bottom 0.254: v14.76,35.05 14.76,36.83 v14.25,37.34
P6.1_URXD_J1.3  (via drill 0.3)
  Top 0.254: J1.3 7.65,39.37 12.73,39.37 v13.23,38.86 | 16.8,33.77 16.28,34.29 14,34.29 v13.74,34.54
  Bottom 0.254: v13.74,34.54 13.74,36.32 13.23,36.83 v13.23,38.86
P6.2_IO_J1.5  (via drill 0.3)
  Top 0.254: 16.54,33.27 16.03,33.78 11.2,33.78 v10.95,34.04
  Bottom 0.254: v10.95,34.04 10.69,34.29 7.65,34.29 J1.5
P6.3_IO_J1.8  (via drill 0.3)
  Top 0.254: 16.02,32.77 v15.77,33.02 | v15.52,27.43 10.18,27.43 9.42,26.67 7.65,26.67 J1.8
  Bottom 0.254: v15.77,33.02 15.77,27.69 v15.52,27.43
P7.0_I2CSDA_J1.10  (via drill 0.3)
  Top 0.254: 13.98,31.77 v13.74,32
  Bottom 0.254: v13.74,32 13.74,25.65 9.68,21.59 7.65,21.59 J1.10
P7.1_I2CSCL_J1.9  (via drill 0.3)
  Top 0.254: 12.95,31.27 v12.73,31.5 | v11.2,24.13 7.65,24.13 J1.9
  Bottom 0.254: v12.73,31.5 12.73,25.65 v11.2,24.13
P7.3_CAPTURE_J4.36  (via drill 0.3)
  Top 0.254: v42.7,37.08 v37.87,37.08 | 26.98,35.34 28.47,36.83 v33.55,36.83
  Bottom 0.254: J4.36 44.22,35.56 v42.7,37.08 | v37.87,37.08 33.81,37.08 v33.55,36.83
P8.0_IO_J3.30  (via drill 0.3)
  Top 0.254: 11.93,30.77 v11.71,30.99
  Bottom 0.254: v11.71,30.99 11.71,25.65 J3.30
P8.1_IO_J2.11
  Top 0.254: 46.2,29.77 47.52,28.45 47.52,25.4 48.79,24.13 50.83,24.13 J2.11
P8.2_IO_J2.12
  Top 0.254: 46.46,30.27 48.03,28.7 48.03,27.43 48.79,26.67 50.83,26.67 J2.12
P8.3_IO_J2.13
  Top 0.254: 46.73,30.77 48.29,29.21 50.83,29.21 J2.13
TGT_GND  (via drill 0.3)
  other vias: 13.23,52.58 17.2,2.03 30.02,51.44 8.15,8.64 8.15,6.35 8.15,3.81 7.26,11.3 11.2,10.41 11.96,6.35 20.6,14.73 33.55,1.91 19.33,42.04 18.95,38.61 24.28,19.05 18.95,25.91 37.49,25.65 38.4,52.7 37.64,48.9 19.86,50.93 26.47,55.24 23.27,20.07 22.76,18.03 30.12,14.73 25.3,4.57 51.87,55.5 42.98,51.94 53.64,51.44 40.94,39.24 11.73,48.9 1.83,54.23 3.35,41.53 3.35,29.08 2.08,7.49 12.5,20.45 31.55,18.92 55.93,10.03 55.42,31.62 55.17,41.78 41.2,27.81
  pour Top: 0.02,56.64 0.02,0 58.45,0 58.45,56.64
  pour MidBottom: 0.02,56.64 0.02,0 58.45,0 58.45,56.64
  pour Bottom: 0.02,56.64 0.02,0 58.45,0 58.45,56.64

### Text on the board
tPlace: RST | P5.6 | P5.5 | P1.0 | P1.1
tNames: microSD
tDocu: IC103 | eZ-FET Rev1.3 | Rev1.1 | MSP430FR5994 | MSP-EXP430FR5994 | RXD << | TXD >> | SBWTDIO | SBWTCK | P3.7 | P1.2 | P3.6 | P5.7 | P6.1 | P3.5 | P3.0 | P4.4 | P6.0 | P3.4 | P3.1 | P5.3 | P6.2 | P7.3 | P3.2 | !RST | P1.3 | P2.6 | P3.3 | P5.0 | P5.2 | P2.5 | P1.4 | P5.1 | P6.3 | P4.3 | P1.5 | P8.3 | P7.1 | P4.2 | P4.7 | P8.2 | P7.0 | P4.1 | P8.0 | P8.1 | Supercap C1 | Use | Charge
tSilk: J | C